# EAGLE design relay (EAGLE 5.07)
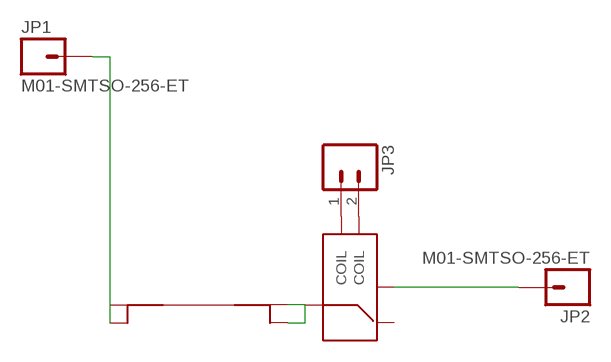
[diagram p0: schematic, sheet 1]

## Parts
JP1  M01-SMTSO-256-ET  [SMTSO-256-ET]
JP2  M01-SMTSO-256-ET  [SMTSO-256-ET]
JP3  M02LOCK  [1X02_LOCK]
U$1  G5LE  [G5LE]
U$2  FUSE521  [FUSE521]

## Nets
N$1: U$1.HOT U$2.OUT1 U$2.OUT2
N$2: JP1.P$1 U$2.IN1 U$2.IN2
N$3: JP2.P$1 U$1.OUT_NO
N$4: JP3.1 U$1.IN2(COIL)
N$5: JP3.2 U$1.IN1(COIL)
Unconnected: U$1.OUT_NC

## Library data of the parts
JP1 JP2 = SparkFun:M01: Header 1 Standard 1-pin 0.1" header. Use with straight break away headers (SKU : PRT-00116), right angle break away headers (PRT-00553), swiss pins (PRT-00743), machine pins (PRT-00117), and female headers (PRT-00115).
JP3 = SparkFun:M02: Header 2 Standard 2-pin 0.1" header. Use with straight break away headers (SKU : PRT-00116), right angle break away headers (PRT-00553), swiss pins (PRT-00743), machine pins (PRT-00117), and female headers (PRT-00115). Molex polarized connector foot print use with SKU : PRT-08233 with associated crimp pins and housings.
U$1 = JoesCustom:G5LE
U$2 = JoesCustom:FUSE521

## Board
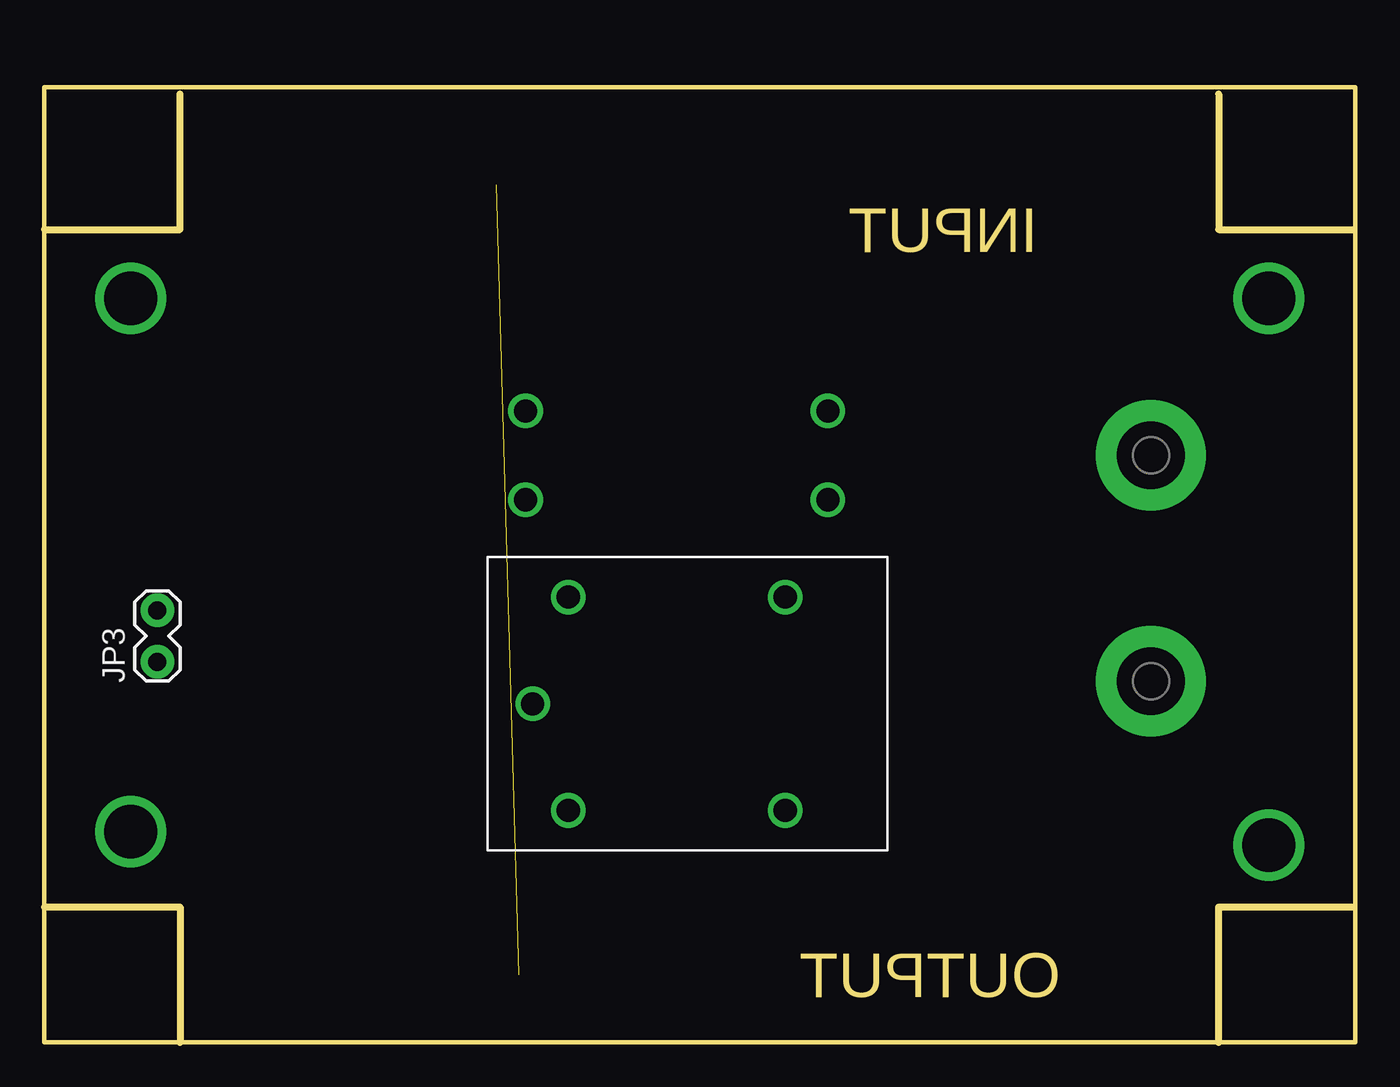
[diagram p1: board, top side]
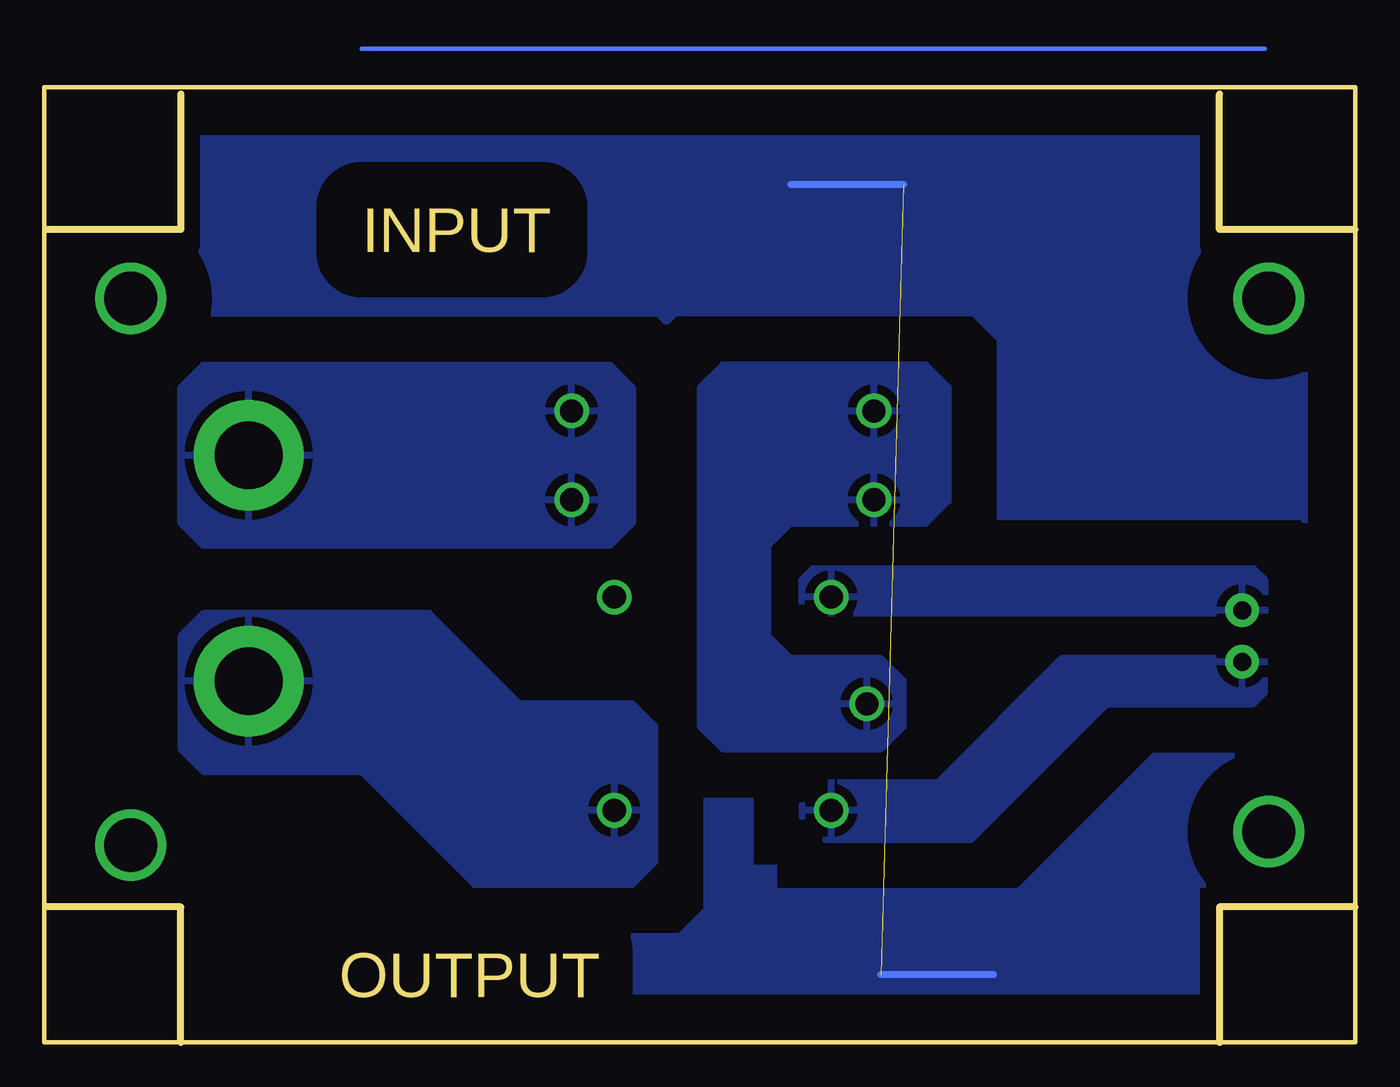
[diagram p2: board, bottom side, seen from below]

Size 73.71 x 53.72 mm. Coordinates in mm from the lower left corner, seen from the top.
Outline: 0,0 73.71,0 73.71,53.72 0,53.72 0,0
Copper layers (1*16): Top 0.035mm / dielectric 1.5mm / Bottom 0.035mm
Design rules "default *": minimum track width 10mil, minimum drill 24mil, track to track 8mil, track to pad 8mil, pad to pad 8mil, via to via 8mil, smd to smd 8mil, copper to edge 40mil, drill to drill 8mil, minimum pad ring 10mil, minimum via ring 8mil, stop-mask expansion 4mil, vias tented up to drill 0mil, thermal gap 20mil
bRestrict: area 45.7,44.5 to 55.9,47; area 43.2,2.5 to 57.1,5.1
Milling: 8 lines

### Footprints (pad centres in the part's own frame; a part is rotated, then mirrored left to right if it is on the bottom)
SMTSO-256-ET = drill 3.81 pad 6.198 round: P$1 0,0
1X02_LOCK = drill 1.016 pad 1.88 round: 1 -0.178,0; 2 2.718,0
G5LE = drill 1.3 round: HOT -8.1,0; IN1 -6.1,6; IN2 -6.1,-6; OUT_NC 6.1,6; OUT_NO 6.1,-6
FUSE521 = drill 1.3 round: IN1 -8.5,2.5; IN2 -8.5,-2.5; OUT1 8.5,2.5; OUT2 8.5,-2.5

### Placement (x,y rotation side)
JP1  62.23,33.02 0 top
JP2  62.23,20.32 0 top
JP3  6.35,21.59 90 top
U$1  35.56,19.05 0 top
U$2  35.56,33.02 180 top

### Tracks (layer width: path | path; a pad name or v marks a point on that pad's centre or on a via)
GND  (1 unrouted)
  Bottom 0.406: 25.4,48.26 31.75,48.26 | 20.32,3.81 26.67,3.81
  pour Bottom (isolate 2.54, rank 2): 0,44.45 8.89,44.45 8.89,53.34 64.77,53.34 64.77,44.45 73.66,44.45 73.66,8.89 64.77,8.89 64.77,0 8.89,0 8.89,8.89 0,8.89
N$1
  pour Bottom: 36.83,29.21 36.83,17.78 35.56,16.51 26.67,16.51 25.4,17.78 25.4,20.32 26.67,21.59 31.75,21.59 33.02,22.86 33.02,27.94 31.75,29.21 24.13,29.21 22.86,30.48 22.86,36.83 24.13,38.1 35.56,38.1 36.83,36.83
N$2
  pour Bottom: 41.91,27.94 64.77,27.94 66.04,29.21 66.04,36.83 64.77,38.1 41.91,38.1 40.64,36.83 40.64,29.21
N$3
  pour Bottom: 52.07,24.13 64.77,24.13 66.04,22.86 66.04,16.51 64.77,15.24 55.88,15.24 49.53,8.89 40.64,8.89 39.37,10.16 39.37,17.78 40.64,19.05 46.99,19.05
N$4
  pour Bottom: 5.08,21.59 16.51,21.59 23.5,14.61 29.84,14.61 31.11,13.34 31.11,12.7 29.84,11.43 21.59,11.43 13.97,19.05 5.71,19.05 5.08,19.68
N$5
  pour Bottom: 5.08,24.13 30.48,24.13 31.11,24.77 31.11,26.04 30.48,26.67 5.71,26.67 5.08,26.04
N$6  (via drill 3)
  other vias: 4.85,41.86
N$7  (via drill 3)
  other vias: 4.85,11.86
N$8  (via drill 3)
  other vias: 68.86,41.86
N$9  (via drill 3)
  other vias: 68.86,11.1
N$10
  Bottom 0.254: 5.08,55.88 55.88,55.88

### Text on the board
Milling: INPUT | OUTPUT